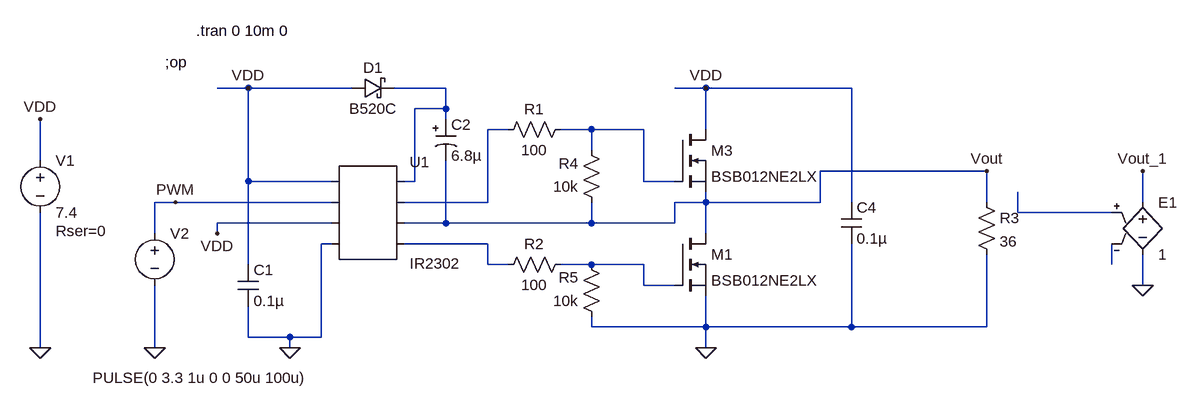
[diagram p0: schematic Half_H_Bridge.asc]
Half_H_Bridge.asc, the LTspice schematic file:
Version 4
SHEET 1 1464 680
WIRE -144 -32 -192 -32
WIRE 16 -32 -144 -32
WIRE 160 -32 80 -32
WIRE 560 -32 512 -32
WIRE 784 -32 560 -32
WIRE 160 0 160 -32
WIRE 160 0 112 0
WIRE 160 16 160 0
WIRE 256 32 224 32
WIRE 384 32 336 32
WIRE 464 32 384 32
WIRE 560 32 560 -32
WIRE 384 64 384 32
WIRE -464 80 -464 16
WIRE 992 96 736 96
WIRE -144 112 -144 -32
WIRE -16 112 -144 112
WIRE 112 112 112 0
WIRE 112 112 96 112
WIRE 464 112 464 32
WIRE 512 112 464 112
WIRE -256 144 -288 144
WIRE -16 144 -256 144
WIRE 224 144 224 32
WIRE 224 144 96 144
WIRE 560 144 560 128
WIRE 560 144 512 144
WIRE 736 144 736 96
WIRE 736 144 560 144
WIRE 784 144 784 -32
WIRE 992 144 992 96
WIRE 1232 144 1232 96
WIRE 1040 160 1040 128
WIRE 1184 160 1040 160
WIRE -16 176 -192 176
WIRE 160 176 160 80
WIRE 160 176 96 176
WIRE 384 176 384 144
WIRE 384 176 160 176
WIRE 512 176 512 144
WIRE 512 176 384 176
WIRE -288 192 -288 144
WIRE -192 192 -192 176
WIRE 560 192 560 144
WIRE -16 208 -32 208
WIRE 224 208 96 208
WIRE -144 240 -144 112
WIRE 224 240 224 208
WIRE 256 240 224 240
WIRE 384 240 336 240
WIRE 464 240 384 240
WIRE 1184 240 1184 208
WIRE 464 272 464 240
WIRE 512 272 464 272
WIRE 1232 272 1232 224
WIRE 384 336 384 320
WIRE 560 336 560 288
WIRE 560 336 384 336
WIRE 784 336 784 208
WIRE 784 336 560 336
WIRE 992 336 992 224
WIRE 992 336 784 336
WIRE -144 352 -144 304
WIRE -80 352 -144 352
WIRE -32 352 -32 208
WIRE -32 352 -80 352
WIRE -464 368 -464 160
WIRE -288 368 -288 272
WIRE -80 368 -80 352
WIRE 560 368 560 336
FLAG -80 368 0
FLAG 560 368 0
FLAG -464 368 0
FLAG -464 16 VDD
FLAG 560 -32 VDD
FLAG -144 -32 VDD
FLAG -288 368 0
FLAG 992 96 Vout
FLAG 1232 272 0
FLAG 1232 96 Vout_1
FLAG -256 144 PWM
FLAG -192 192 VDD
SYMBOL schottky 16 -16 R270
WINDOW 0 32 32 VTop 2
WINDOW 3 0 32 VBottom 2
SYMATTR InstName D1
SYMATTR Value B520C
SYMATTR Description Diode
SYMATTR Type diode
SYMBOL res 352 16 R90
WINDOW 0 0 56 VBottom 2
WINDOW 3 32 56 VTop 2
SYMATTR InstName R1
SYMATTR Value 100
SYMATTR SpiceLine tol=1 pwr=0.1
SYMBOL AutoGenerated\\IR2302 32 160 R0
SYMATTR InstName U1
SYMBOL res 352 224 R90
WINDOW 0 0 56 VBottom 2
WINDOW 3 32 56 VTop 2
SYMATTR InstName R2
SYMATTR Value 100
SYMATTR SpiceLine tol=1 pwr=0.1
SYMBOL nmos 512 32 R0
SYMATTR InstName M3
SYMATTR Value BSB012NE2LX
SYMBOL nmos 512 192 R0
SYMATTR InstName M1
SYMATTR Value BSB012NE2LX
SYMBOL cap -160 240 R0
SYMATTR InstName C1
SYMATTR Value 0.1µ
SYMATTR SpiceLine V=16 Irms=728m Rser=0.14361 Lser=0 mfg="KEMET" pn="C0603C104K4RAC" type="X7R"
SYMBOL polcap 144 16 R0
WINDOW 3 24 56 Left 2
SYMATTR Value 6.8µ
SYMATTR InstName C2
SYMATTR Description Capacitor
SYMATTR Type cap
SYMATTR SpiceLine V=50 Irms=1.44145 Rser=0.09 Lser=0 mfg="KEMET" pn="T521V685M050ATE090" type="Tantalum"
SYMBOL voltage -464 64 R0
WINDOW 123 0 0 Left 0
WINDOW 39 24 124 Left 2
SYMATTR SpiceLine Rser=0
SYMATTR InstName V1
SYMATTR Value 7.4
SYMBOL voltage -288 176 R0
WINDOW 123 0 0 Left 0
WINDOW 39 0 0 Left 0
WINDOW 3 -95 238 Left 2
SYMATTR Value PULSE(0 3.3 1u 0 0 50u 100u)
SYMATTR InstName V2
SYMBOL cap 768 144 R0
SYMATTR InstName C4
SYMATTR Value 0.1µ
SYMATTR SpiceLine V=16 Irms=728m Rser=0.14361 Lser=0 mfg="KEMET" pn="C0603C104K4RAC" type="X7R"
SYMBOL res 976 128 R0
SYMATTR InstName R3
SYMATTR Value 36
SYMBOL e 1232 128 R0
SYMATTR InstName E1
SYMATTR Value 1
SYMBOL res 400 160 R180
WINDOW 0 36 76 Left 2
WINDOW 3 36 40 Left 2
SYMATTR InstName R4
SYMATTR Value 10k
SYMATTR SpiceLine tol=1 pwr=0.1
SYMBOL res 400 336 R180
WINDOW 0 36 76 Left 2
WINDOW 3 36 40 Left 2
SYMATTR InstName R5
SYMATTR Value 10k
SYMATTR SpiceLine tol=1 pwr=0.1
TEXT -224 -120 Left 2 !.tran 0 10m 0
TEXT -272 -72 Left 2 !;op

The netlist it stands for:
* Half_H_Bridge.asc
D1 VDD N001 B520C
R1 N003 N002 100 tol=1 pwr=0.1
* U1: IR2302 (symbol AutoGenerated\IR2302 not available, pins judged from their places): pin1=VDD pin2=PWM pin3=VDD pin4=0 pin5=N001 pin6=N002 pin7=Vout pin8=N005
R2 N006 N005 100 tol=1 pwr=0.1
M3 VDD N003 Vout Vout BSB012NE2LX
M1 Vout N006 0 0 BSB012NE2LX
C1 VDD 0 0.1µ V=16 Irms=728m Rser=0.14361 Lser=0 mfg="KEMET" pn="C0603C104K4RAC" type="X7R"
C2 N001 Vout 6.8µ V=50 Irms=1.44145 Rser=0.09 Lser=0 mfg="KEMET" pn="T521V685M050ATE090" type="Tantalum"
V1 VDD 0 7.4 Rser=0
V2 PWM 0 PULSE(0 3.3 1u 0 0 50u 100u)
C4 VDD 0 0.1µ V=16 Irms=728m Rser=0.14361 Lser=0 mfg="KEMET" pn="C0603C104K4RAC" type="X7R"
R3 Vout 0 36
E1 Vout_1 0 N004 N007 1
R4 Vout N003 10k tol=1 pwr=0.1
R5 0 N006 10k tol=1 pwr=0.1
.model D D
.lib standard.dio
.model NMOS NMOS
.model PMOS PMOS
.lib standard.mos
.tran 0 10m 0
;op
.backanno
.end